# EAGLE design RaspberryPi Econet Module Adapter - Issue 1 (EAGLE 7.7.0)
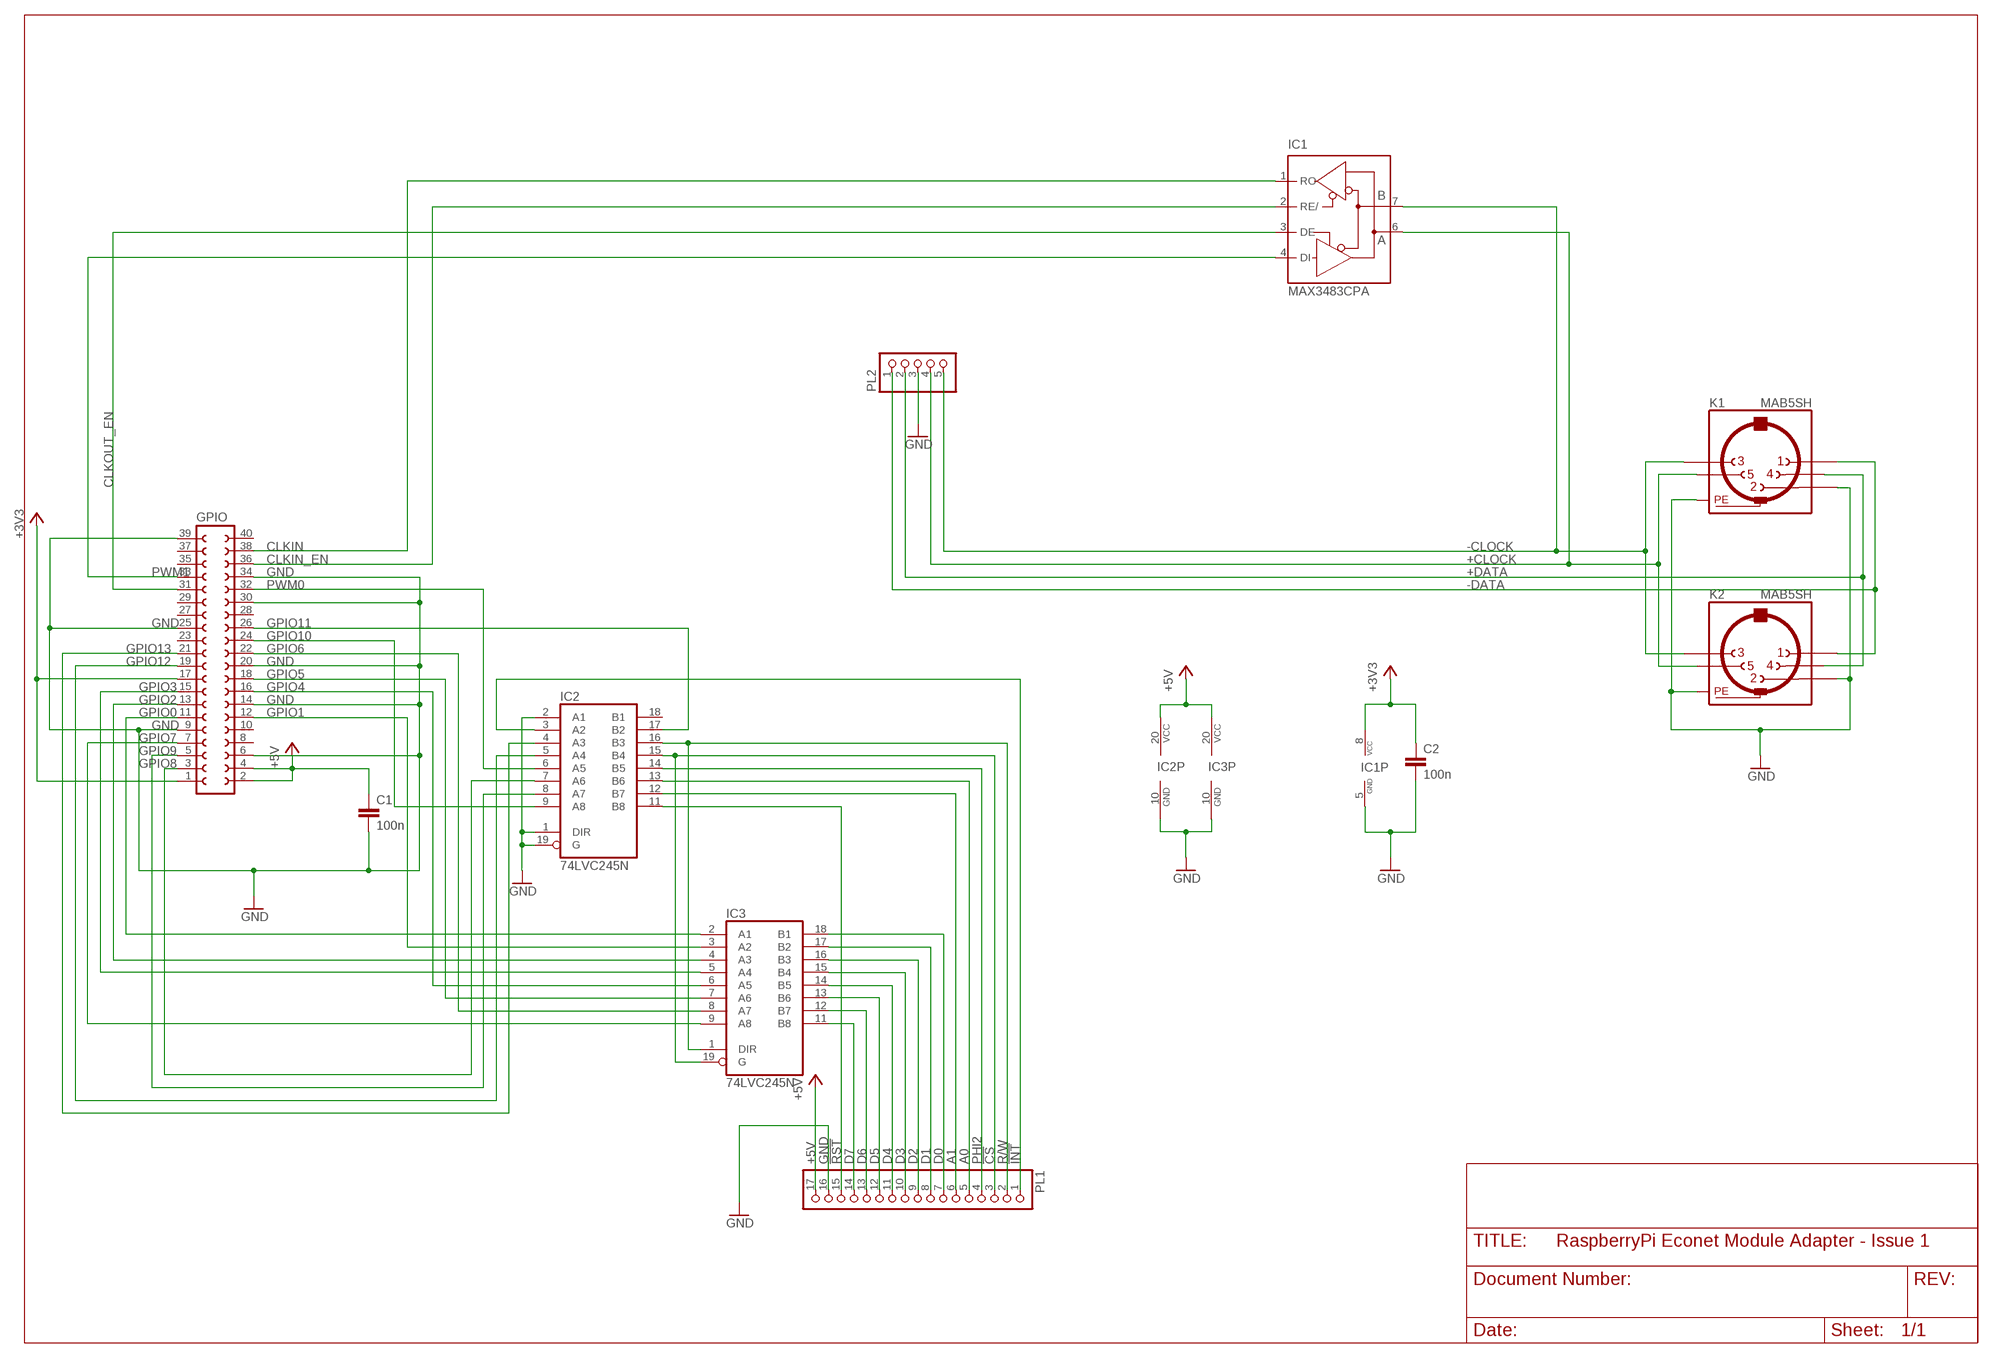
[diagram p0: schematic, sheet 1]

## Parts
C1  100n  C-EU050-025X075  [C050-025X075]
C2  100n  C-EU050-025X075  [C050-025X075]
GPIO  FE20-2  [FE20-2]
IC1  MAX3483CPA  MAX481CPA  [DIL08]
IC2  74LVC245N  74LS245N  [DIL20]
IC3  74LVC245N  74LS245N  [DIL20]
K1  MAB5SH  [MAB5SH]
K2  MAB5SH  [MAB5SH]
PL1  PINHD-1X17  [1X17]
PL2  PINHD-1X5  [1X05]

## Nets
!CS: IC2.15(B4) IC3.19(G) PL1.3
!INT: IC2.3(A2) PL1.1
!RST: IC2.11(B8) PL1.15
+3V3: C2.1 GPIO.1 GPIO.17 IC1.8(VCC)
+5V: C1.1 GPIO.2 GPIO.4 IC2.20(VCC) IC3.20(VCC) PL1.17
+CLOCK: IC1.6(A) K1.5 K2.5 PL2.4
+DATA: K1.4 K2.4 PL2.2
-CLOCK: IC1.7(B) K1.3 K2.3 PL2.5
-DATA: K1.1 K2.1 PL2.1
A0: IC2.13(B6) PL1.5
A1: IC2.12(B7) PL1.6
CLKIN: GPIO.38 IC1.1(RO)
CLKIN_EN: GPIO.36 IC1.2(RE/)
CLKOUT_EN: GPIO.31 IC1.3(DE)
D0: IC3.18(B1) PL1.7
D1: IC3.17(B2) PL1.8
D2: IC3.16(B3) PL1.9
D3: IC3.15(B4) PL1.10
D4: IC3.14(B5) PL1.11
D5: IC3.13(B6) PL1.12
D6: IC3.12(B7) PL1.13
D7: IC3.11(B8) PL1.14
GND: C1.2 C2.2 GPIO.6 GPIO.9 GPIO.14 GPIO.20 GPIO.25 GPIO.30 GPIO.34 GPIO.39 IC1.5(GND) IC2.1(DIR) IC2.2(A1) IC2.10(GND) IC2.19(G) IC3.10(GND) K1.2 K1.PE K1.PE@(PE) K2.2 K2.PE K2.PE@(PE) PL1.16 PL2.3
GPIO0: GPIO.11 IC3.2(A1)
GPIO1: GPIO.12 IC3.3(A2)
GPIO2: GPIO.13 IC3.4(A3)
GPIO3: GPIO.15 IC3.5(A4)
GPIO4: GPIO.16 IC3.6(A5)
GPIO5: GPIO.18 IC3.7(A6)
GPIO6: GPIO.22 IC3.8(A7)
GPIO7: GPIO.7 IC3.9(A8)
GPIO8: GPIO.3 IC2.7(A6)
GPIO9: GPIO.5 IC2.8(A7)
GPIO10: GPIO.24 IC2.9(A8)
GPIO11: GPIO.26 IC2.17(B2)
GPIO12: GPIO.19 IC2.5(A4)
GPIO13: GPIO.21 IC2.4(A3)
PHI2: IC2.14(B5) PL1.4
PWM0: GPIO.32 IC2.6(A5)
PWM1: GPIO.33 IC1.4(DI)
R/W: IC2.16(B3) IC3.1(DIR) PL1.2
Unconnected: GPIO.8 GPIO.10 GPIO.23 GPIO.27 GPIO.28 GPIO.29 GPIO.35 GPIO.37 GPIO.40 IC2.18(B1)

## Library data of the parts
C1 C2 = rcl:C-EU: CAPACITOR, European symbol
GPIO = con-lsta:FE20-2: FEMALE HEADER; OC_FARNELL: unknown; OC_NEWARK: unknown
IC1 = maxim:MAX481CPA: RS485 TRANSEIVER; MPN: MAX481CPA+; OC_FARNELL: unknown; OC_NEWARK: 99K3445
IC2 IC3 = 74xx-us:74*245: Octal BUS TRANSCEIVER, 3-state
K1 K2 = con-hirschmann:MAB5SH: Female CONNECTOR 5 pins 90 deg. with shield, horizontal (DIN 41524); OC_FARNELL: 809883; OC_NEWARK: unknown
PL1 = pinhead:PINHD-1X17: PIN HEADER
PL2 = pinhead:PINHD-1X5: PIN HEADER

## Board
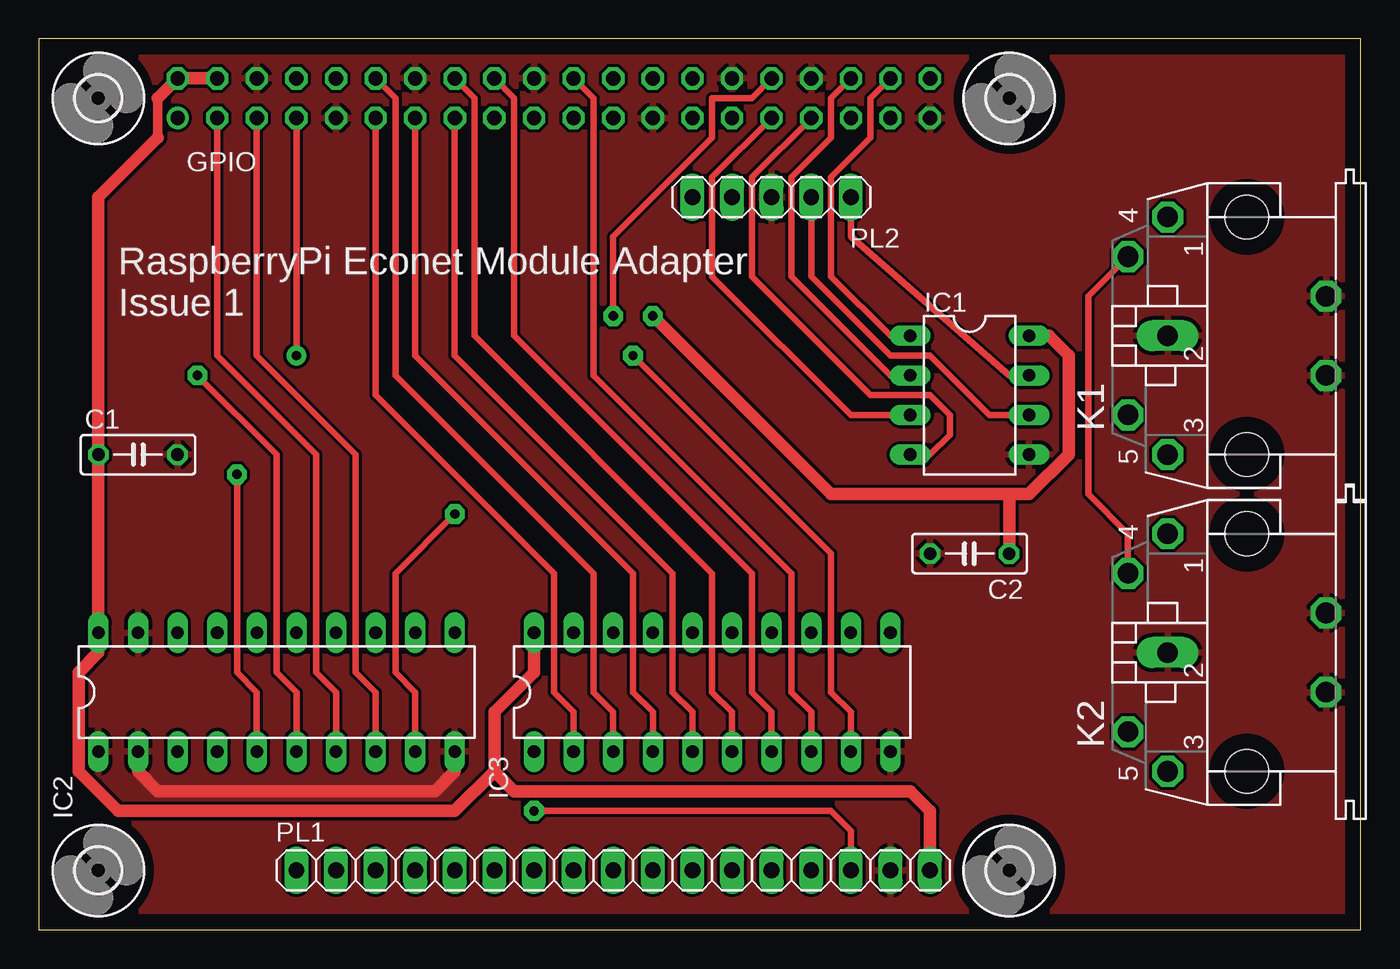
[diagram p1: board, top side]
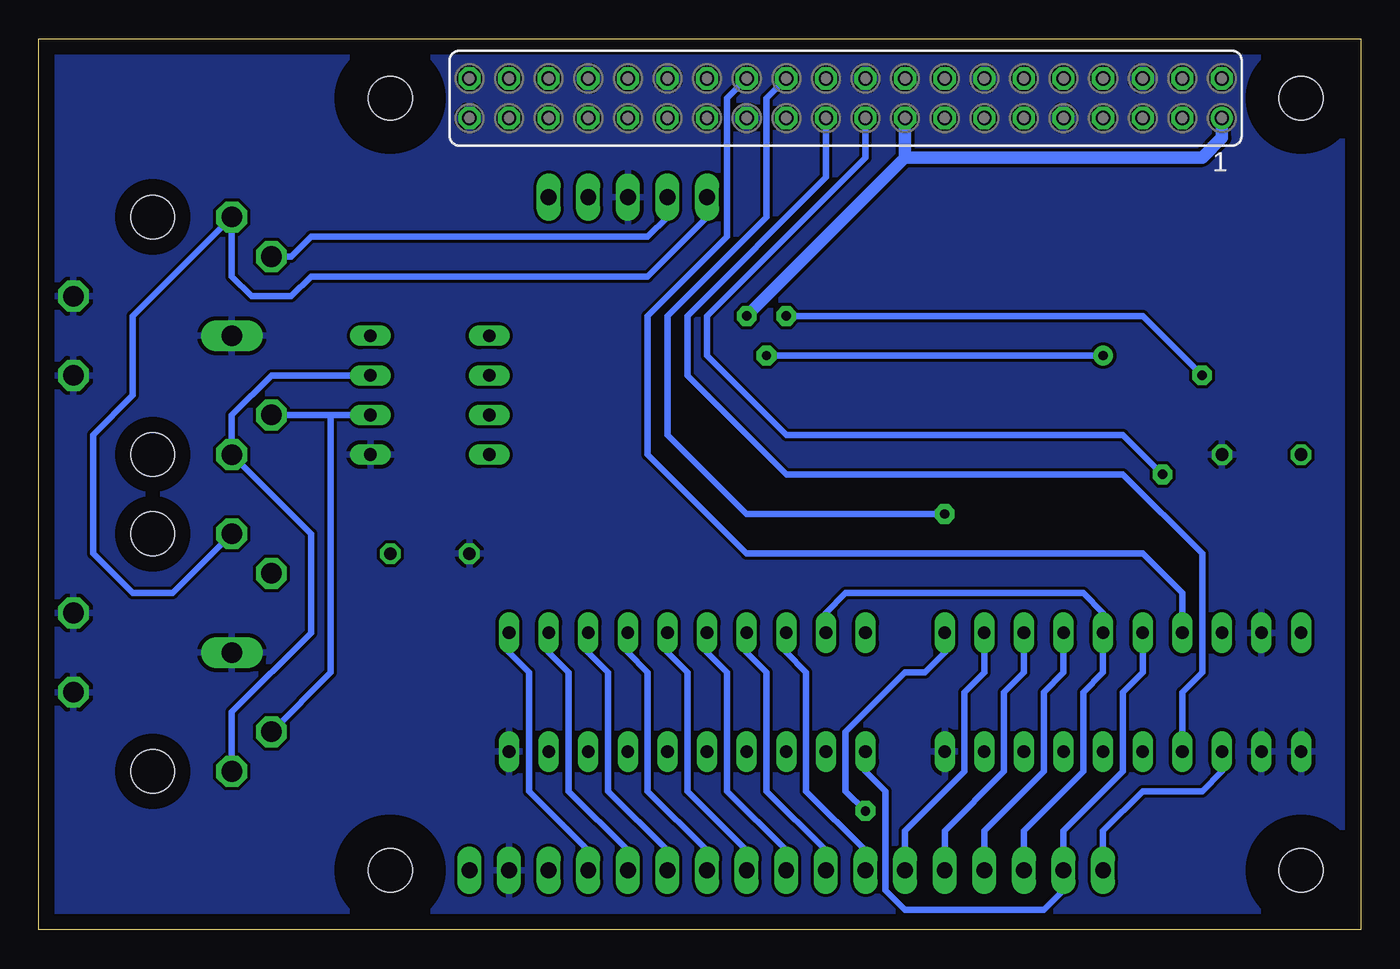
[diagram p2: board, bottom side, seen from below]

Size 84.76 x 57.14 mm. Coordinates in mm from the lower left corner, seen from the top.
Outline: 0,0 84.76,0 84.76,57.14 0,57.14 0,0
Copper layers (1*16): Top 0.035mm / dielectric 1.5mm / Bottom 0.035mm
Design rules "default": minimum track width 10mil, minimum drill 24mil, track to track 8mil, track to pad 8mil, pad to pad 8mil, via to via 8mil, smd to smd 8mil, copper to edge 40mil, drill to drill 8mil, minimum pad ring 10mil, minimum via ring 8mil, stop-mask expansion 4mil, vias tented up to drill 0mil, thermal gap 10mil

### Footprints (pad centres in the part's own frame; a part is rotated, then mirrored left to right if it is on the bottom)
C050-025X075 = drill 0.813 octagon: 1 -2.54,0; 2 2.54,0
FE20-2 = drill 0.914: 1 -24.13,1.27 | drill 0.914 octagon: 2 -24.13,-1.27; 3 -21.59,1.27; 4 -21.59,-1.27; 5 -19.05,1.27; 6 -19.05,-1.27; 7 -16.51,1.27; 8 -16.51,-1.27; 9 -13.97,1.27; 10 -13.97,-1.27; 11 -11.43,1.27; 12 -11.43,-1.27; 13 -8.89,1.27; 14 -8.89,-1.27; 15 -6.35,1.27; 16 -6.35,-1.27; 17 -3.81,1.27; 18 -3.81,-1.27; 19 -1.27,1.27; 20 -1.27,-1.27; 21 1.27,1.27; 22 1.27,-1.27; 23 3.81,1.27; 24 3.81,-1.27; 25 6.35,1.27; 26 6.35,-1.27; 27 8.89,1.27; 28 8.89,-1.27; 29 11.43,1.27; 30 11.43,-1.27; 31 13.97,1.27; 32 13.97,-1.27; 33 16.51,1.27; 34 16.51,-1.27; 35 19.05,1.27; 36 19.05,-1.27; 37 21.59,1.27; 38 21.59,-1.27; 39 24.13,1.27; 40 24.13,-1.27
DIL08 = drill 0.813 long: 1 -3.81,-3.81; 2 -1.27,-3.81; 3 1.27,-3.81; 4 3.81,-3.81; 5 3.81,3.81; 6 1.27,3.81; 7 -1.27,3.81; 8 -3.81,3.81
DIL20 = drill 0.813 long: 1 -11.43,-3.81; 2 -8.89,-3.81; 3 -6.35,-3.81; 4 -3.81,-3.81; 5 -1.27,-3.81; 6 1.27,-3.81; 7 3.81,-3.81; 8 6.35,-3.81; 9 8.89,-3.81; 10 11.43,-3.81; 11 11.43,3.81; 12 8.89,3.81; 13 6.35,3.81; 14 3.81,3.81; 15 1.27,3.81; 16 -1.27,3.81; 17 -3.81,3.81; 18 -6.35,3.81; 19 -8.89,3.81; 20 -11.43,3.81
MAB5SH = drill 1.321 octagon: 1 7.62,5.08; 3 -7.62,5.08; 4 5.08,7.62; 5 -5.08,7.62; PE -2.54,-5.08; PE@ 2.54,-5.08 | drill 1.321 long: 2 0,5.08 | hole 2.794: 7.62,0; -7.62,0
1X17 = drill 1.016 long: 1 -20.32,0; 2 -17.78,0; 3 -15.24,0; 4 -12.7,0; 5 -10.16,0; 6 -7.62,0; 7 -5.08,0; 8 -2.54,0; 9 0,0; 10 2.54,0; 11 5.08,0; 12 7.62,0; 13 10.16,0; 14 12.7,0; 15 15.24,0; 16 17.78,0; 17 20.32,0
1X05 = drill 1.016 long: 1 -5.08,0; 2 -2.54,0; 3 0,0; 4 2.54,0; 5 5.08,0
2,8 = hole 2.8: 0,0

### Placement (x,y rotation side)
C1  6.35,30.48 0 top
C2  59.69,24.13 180 top
GPIO  33.02,53.34 180 bottom
IC1  59.69,34.29 270 top
IC2  15.24,15.24 0 top
IC3  43.18,15.24 0 top
K1  77.47,38.1 90 top
K2  77.47,17.78 90 top
PL1  36.83,3.81 0 top
PL2  46.99,46.99 0 top
U$1  [2,8]  3.81,53.34 0 top
U$2  [2,8]  62.23,53.34 0 top
U$3  [2,8]  3.81,3.81 0 top
U$4  [2,8]  62.23,3.81 0 top

### Tracks (layer width: path | path; a pad name or v marks a point on that pad's centre or on a via)
!CS
  Bottom 0.406: PL1.3 21.59,6.35 17.78,10.16 17.78,15.24 16.51,16.51 IC2.15 16.51,20.32 17.78,21.59 33.02,21.59 34.29,20.32 IC3.19
!INT
  Bottom 0.406: PL1.1 16.51,6.35 13.97,8.89 10.16,8.89 8.89,10.16 IC2.3
!RST  (via drill 0.6 pad 1.27)
  Top 0.406: PL1.15 52.07,6.35 50.8,7.62 v31.75,7.62
  Bottom 0.406: v31.75,7.62 33.02,8.89 33.02,12.7 29.21,16.51 27.94,16.51 26.67,17.78 IC2.11
+3V3  (via drill 0.6 pad 1.27)
  Top 0.813: v39.37,39.37 50.8,27.94 62.23,27.94 | 62.23,27.94 63.5,27.94 66.04,30.48 66.04,36.83 64.77,38.1 IC1.8 | C2.1 62.23,27.94
  Bottom 0.813: 29.21,49.53 v39.37,39.37 | GPIO.17 29.21,49.53 | 29.21,49.53 10.16,49.53 8.89,50.8 GPIO.1
+5V
  Top 0.61: 7.62,50.8 7.62,53.34
  Top 0.813: GPIO.4 GPIO.2 7.62,53.34 | PL1.17 57.15,7.62 55.88,8.89 30.48,8.89 29.21,10.16 | 29.21,10.16 29.21,13.97 31.75,16.51 IC3.20 | 29.21,10.16 26.67,7.62 5.08,7.62 2.54,10.16 2.54,16.51 3.81,17.78 IC2.20 C1.1 3.81,46.99 7.62,50.8
+CLOCK
  Top 0.406: PL2.4 49.53,41.91 54.61,36.83 57.15,36.83 60.96,33.02 IC1.6
  Bottom 0.406: K1.5 66.04,33.02 | 66.04,33.02 66.04,16.51 K2.5 | IC1.6 66.04,33.02
+DATA
  Top 0.406: K1.4 67.31,40.64 67.31,27.94 69.85,25.4 K2.4
  Bottom 0.406: K1.4 68.58,43.18 67.31,44.45 45.72,44.45 44.45,45.72 PL2.2
-CLOCK
  Top 0.406: IC1.7 62.23,35.56 52.07,44.45 PL2.5
  Bottom 0.406: K2.3 72.39,13.97 67.31,19.05 67.31,25.4 K1.3 72.39,33.02 69.85,35.56 IC1.7
-DATA
  Bottom 0.406: K2.1 76.2,21.59 78.74,21.59 81.28,24.13 81.28,31.75 78.74,34.29 78.74,39.37 K1.1 72.39,41.91 71.12,40.64 68.58,40.64 67.31,41.91 45.72,41.91 41.91,45.72 PL2.1
A0
  Bottom 0.406: PL1.5 26.67,6.35 22.86,10.16 22.86,15.24 21.59,16.51 IC2.13
A1
  Bottom 0.406: PL1.6 29.21,6.35 25.4,10.16 25.4,15.24 24.13,16.51 IC2.12
CLKIN
  Top 0.406: GPIO.38 53.34,53.34 53.34,50.8 50.8,48.26 50.8,41.91 54.61,38.1 IC1.1
CLKIN_EN
  Top 0.406: IC1.2 54.61,35.56 48.26,41.91 48.26,48.26 50.8,50.8 50.8,53.34 GPIO.36
CLKOUT_EN
  Top 0.406: GPIO.31 43.18,48.26 43.18,41.91 52.07,33.02 IC1.3
D0
  Bottom 0.406: PL1.7 31.75,5.08 35.56,8.89 35.56,16.51 36.83,17.78 IC3.18
D1
  Bottom 0.406: PL1.8 34.29,5.08 38.1,8.89 38.1,16.51 39.37,17.78 IC3.17
D2
  Bottom 0.406: PL1.9 36.83,5.08 40.64,8.89 40.64,16.51 41.91,17.78 IC3.16
D3
  Bottom 0.406: PL1.10 39.37,5.08 43.18,8.89 43.18,16.51 44.45,17.78 IC3.15
D4
  Bottom 0.406: PL1.11 41.91,5.08 45.72,8.89 45.72,16.51 46.99,17.78 IC3.14
D5
  Bottom 0.406: PL1.12 44.45,5.08 48.26,8.89 48.26,16.51 49.53,17.78 IC3.13
D6
  Bottom 0.406: PL1.13 46.99,5.08 50.8,8.89 50.8,16.51 52.07,17.78 IC3.12
D7
  Bottom 0.406: PL1.14 49.53,5.08 53.34,8.89 53.34,16.51 54.61,17.78 IC3.11
GND
  Top 0.813: IC2.10 26.67,10.16 25.4,8.89 7.62,8.89 6.35,10.16 IC2.2
  pour Bottom: 0,57.15 85.09,57.15 85.09,0 0,0
  pour Top: 0,57.15 85.09,57.15 85.09,0 0,0
GPIO0
  Top 0.406: IC3.2 34.29,13.97 33.02,15.24 33.02,22.86 21.59,34.29 GPIO.11
GPIO1
  Top 0.406: IC3.3 36.83,13.97 35.56,15.24 35.56,22.86 22.86,35.56 22.86,53.34 GPIO.12
GPIO2
  Top 0.406: IC3.4 39.37,13.97 38.1,15.24 38.1,22.86 24.13,36.83 GPIO.13
GPIO3
  Top 0.406: IC3.5 41.91,13.97 40.64,15.24 40.64,22.86 26.67,36.83 GPIO.15
GPIO4
  Top 0.406: IC3.6 44.45,13.97 43.18,15.24 43.18,22.86 27.94,38.1 27.94,53.34 GPIO.16
GPIO5
  Top 0.406: IC3.7 46.99,13.97 45.72,15.24 45.72,22.86 30.48,38.1 30.48,53.34 GPIO.18
GPIO6
  Top 0.406: IC3.8 49.53,13.97 48.26,15.24 48.26,22.86 35.56,35.56 35.56,53.34 GPIO.22
GPIO7  (via drill 0.6 pad 1.27)
  Top 0.406: IC3.9 52.07,13.97 50.8,15.24 50.8,24.13 v38.1,36.83 | v16.51,36.83 GPIO.7
  Bottom 0.406: v38.1,36.83 v16.51,36.83
GPIO8
  Top 0.406: IC2.7 19.05,15.24 17.78,16.51 17.78,30.48 11.43,36.83 GPIO.3
GPIO9
  Top 0.406: IC2.8 21.59,15.24 20.32,16.51 20.32,30.48 13.97,36.83 GPIO.5
GPIO10  (via drill 0.6 pad 1.27)
  Top 0.406: IC2.9 24.13,15.24 22.86,16.51 22.86,22.86 v26.67,26.67
  Bottom 0.406: GPIO.24 38.1,53.34 38.1,45.72 44.45,39.37 44.45,31.75 39.37,26.67 v26.67,26.67
GPIO11
  Bottom 0.406: GPIO.26 40.64,53.34 40.64,44.45 45.72,39.37 45.72,30.48 39.37,24.13 13.97,24.13 11.43,21.59 IC2.17
GPIO12  (via drill 0.61 pad 1.27)
  Top 0.406: IC2.5 13.97,15.24 12.7,16.51 v12.7,29.21
  Bottom 0.406: GPIO.19 31.75,49.53 41.91,39.37 41.91,36.83 36.83,31.75 15.24,31.75 v12.7,29.21
GPIO13
  Bottom 0.406: GPIO.21 34.29,48.26 43.18,39.37 43.18,35.56 36.83,29.21 15.24,29.21 10.16,24.13 10.16,16.51 11.43,15.24 IC2.4
PHI2
  Bottom 0.406: PL1.4 24.13,6.35 20.32,10.16 20.32,15.24 19.05,16.51 IC2.14
PWM0  (via drill 0.6 pad 1.27)
  Top 0.406: IC2.6 16.51,15.24 15.24,16.51 15.24,30.48 v10.16,35.56 | GPIO.32 45.72,53.34 43.18,53.34 43.18,50.8 36.83,44.45 v36.83,39.37
  Bottom 0.406: v36.83,39.37 13.97,39.37 v10.16,35.56
PWM1
  Top 0.406: GPIO.33 45.72,48.26 45.72,41.91 53.34,34.29 57.15,34.29 58.42,33.02 58.42,31.75 57.15,30.48 IC1.4
R/W
  Bottom 0.406: IC2.16 13.97,16.51 15.24,15.24 15.24,10.16 19.05,6.35 PL1.2 19.05,2.54 20.32,1.27 29.21,1.27 30.48,2.54 30.48,8.89 31.75,10.16 IC3.1

### Text on the board
tNames: RaspberryPi Econet Module Adapter / Issue 1